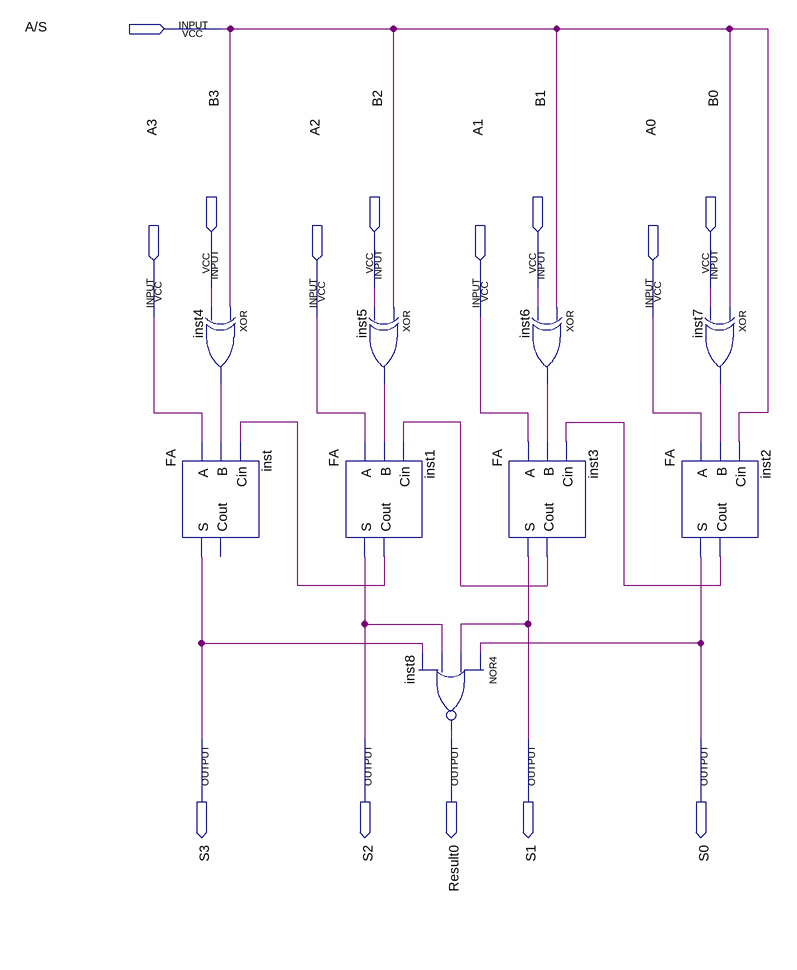
[diagram p0: schematic sheet]
// Quartus schematic Adder.bdf as structural Verilog: 9 symbols, 14 pins
module Adder (
  input  \A/S ,
  input  B3,
  input  B2,
  input  B1,
  input  B0,
  input  A3,
  input  A2,
  input  A1,
  input  A0,
  output S3,
  output S2,
  output Result0,
  output S1,
  output S0
);

  wire inst1_cout, inst2_cout, inst3_cout, inst4_out, inst5_out, inst6_out, inst7_out;

  FA inst (.A(A3), .B(inst4_out), .Cin(inst1_cout), .S(S3));  // open: Cout
  xor inst4 (inst4_out, \A/S , B3);
  FA inst1 (.A(A2), .B(inst5_out), .Cin(inst3_cout), .S(S2), .Cout(inst1_cout));
  xor inst5 (inst5_out, \A/S , B2);
  nor inst8 (Result0, S0, S1, S2, S3);
  FA inst3 (.A(A1), .B(inst6_out), .Cin(inst2_cout), .S(S1), .Cout(inst3_cout));
  xor inst6 (inst6_out, \A/S , B1);
  xor inst7 (inst7_out, \A/S , B0);
  FA inst2 (.A(A0), .B(inst7_out), .Cin(\A/S ), .S(S0), .Cout(inst2_cout));
endmodule
